# Altium schematic sheet OnePhase_MainPower.SchDoc: One phase test
size A4; CheckedBy: Arthur; Author: Hildo Guillardi Júnior; Organization: UNICAMP / LCEE; Address1: University of Campinas - Brazil; Address2: Power Conditioning Laboratory; Address3: Licensed by GNU GPL 3.0; ProjectName: Easy Inverter
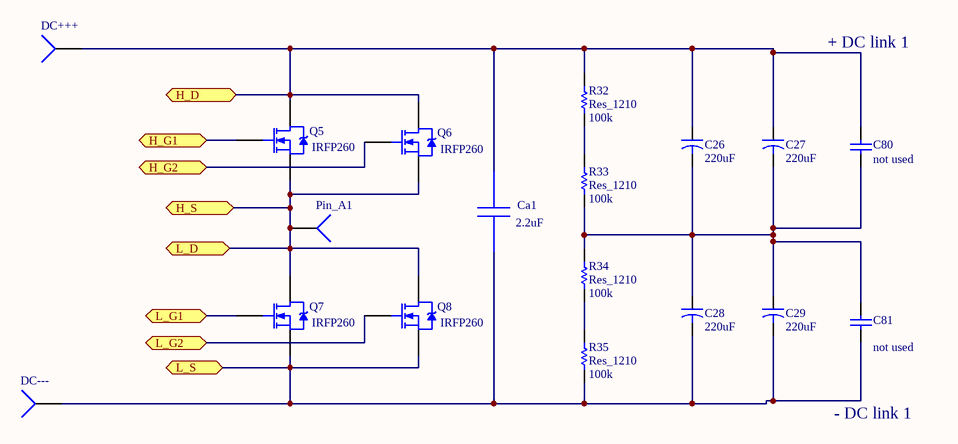
[diagram p0: OnePhase_MainPower.SchDoc]

## Parts
C26  value 220uF  [Capacitor Eletrolitico - duplicate]  (hidden comment: Cap2)
C27  value 220uF  [Capacitor Eletrolitico - duplicate]  (hidden comment: Cap2)
C28  value 220uF  [Capacitor Eletrolitico - duplicate]  (hidden comment: Cap2)
C29  value 220uF  [Capacitor Eletrolitico - duplicate]  (hidden comment: Cap2)
C80  value not used  [Capacitor_Pol_15x6mm]
C81  value not used  [Capacitor_Pol_15x6mm]
Ca1  value 2.2uF  [Capacitor_Pol_2Sizes]
DC+++  Socket  [Power conector]  (value not drawn)
DC---  Socket  [Power conector]  (value not drawn)
Pin_A1  Socket  [Power conector]  (value not drawn)
Q5  IRFP260  [TO227]
Q6  IRFP260  [TO227]
Q7  IRFP260  [TO227]
Q8  IRFP260  [TO227]
R32  Res_1210  value 100k  [1210_W]
R33  Res_1210  value 100k  [1210_W]
R34  Res_1210  value 100k  [1210_W]
R35  Res_1210  value 100k  [1210_W]

## Ports
H_D, H_G1, H_G2, H_S, L_D, L_G1, L_G2, L_S

## Nets
H_D: C26.1 C27.1 C80.2 Ca1.1 DC+++.1 Q5.2(D) Q6.2(D) R32.1 ; port H_D
H_G1: Q5.1(G) ; port H_G1
H_G2: Q6.1(G) ; port H_G2
H_S: Pin_A1.1 Q5.3(S) Q6.3(S) Q7.2(D) Q8.2(D) ; port L_D, port H_S
L_G1: Q7.1(G) ; port L_G1
L_G2: Q8.1(G) ; port L_G2
L_S: C28.2 C29.2 C81.1 Ca1.2 DC---.1 Q7.3(S) Q8.3(S) R35.2 ; port L_S
NetC26_2: C26.2 C27.2 C28.1 C29.1 C80.1 C81.2 R33.2 R34.1
NetR32_2: R32.2 R33.1
NetR34_2: R34.2 R35.1

## Notes on the sheet
- + DC link 1
- - DC link 1
- Title
- Author
- Revisor
- Hildo G Jr
- Revision:
- Sheet
- of
- File:
- Size:
- A4
- HGJr

## Library data of the parts
C26-C29 = Cap2: Capacitor; pn: B43305B9227M000
C80 C81 = Cap: Capacitor
Ca1 = GRM21BC81E475KA12L: GRM21BC81E475KA1; pn: R463R422000M1M
DC+++ DC--- = Socket: pn: 7799; Value: screw
Pin_A1 = Socket: pn: 7799
Q5-Q8 = IRFP260: HEXFET Power MOSFET; pn: 4180G; RM3X10MM 2701; IRFP260MPBF; 28N65M2; C3M0280090D; Value: IRFP260
R32-R35 = Res_0805: Resistor; pn: RMCF1210JT100K